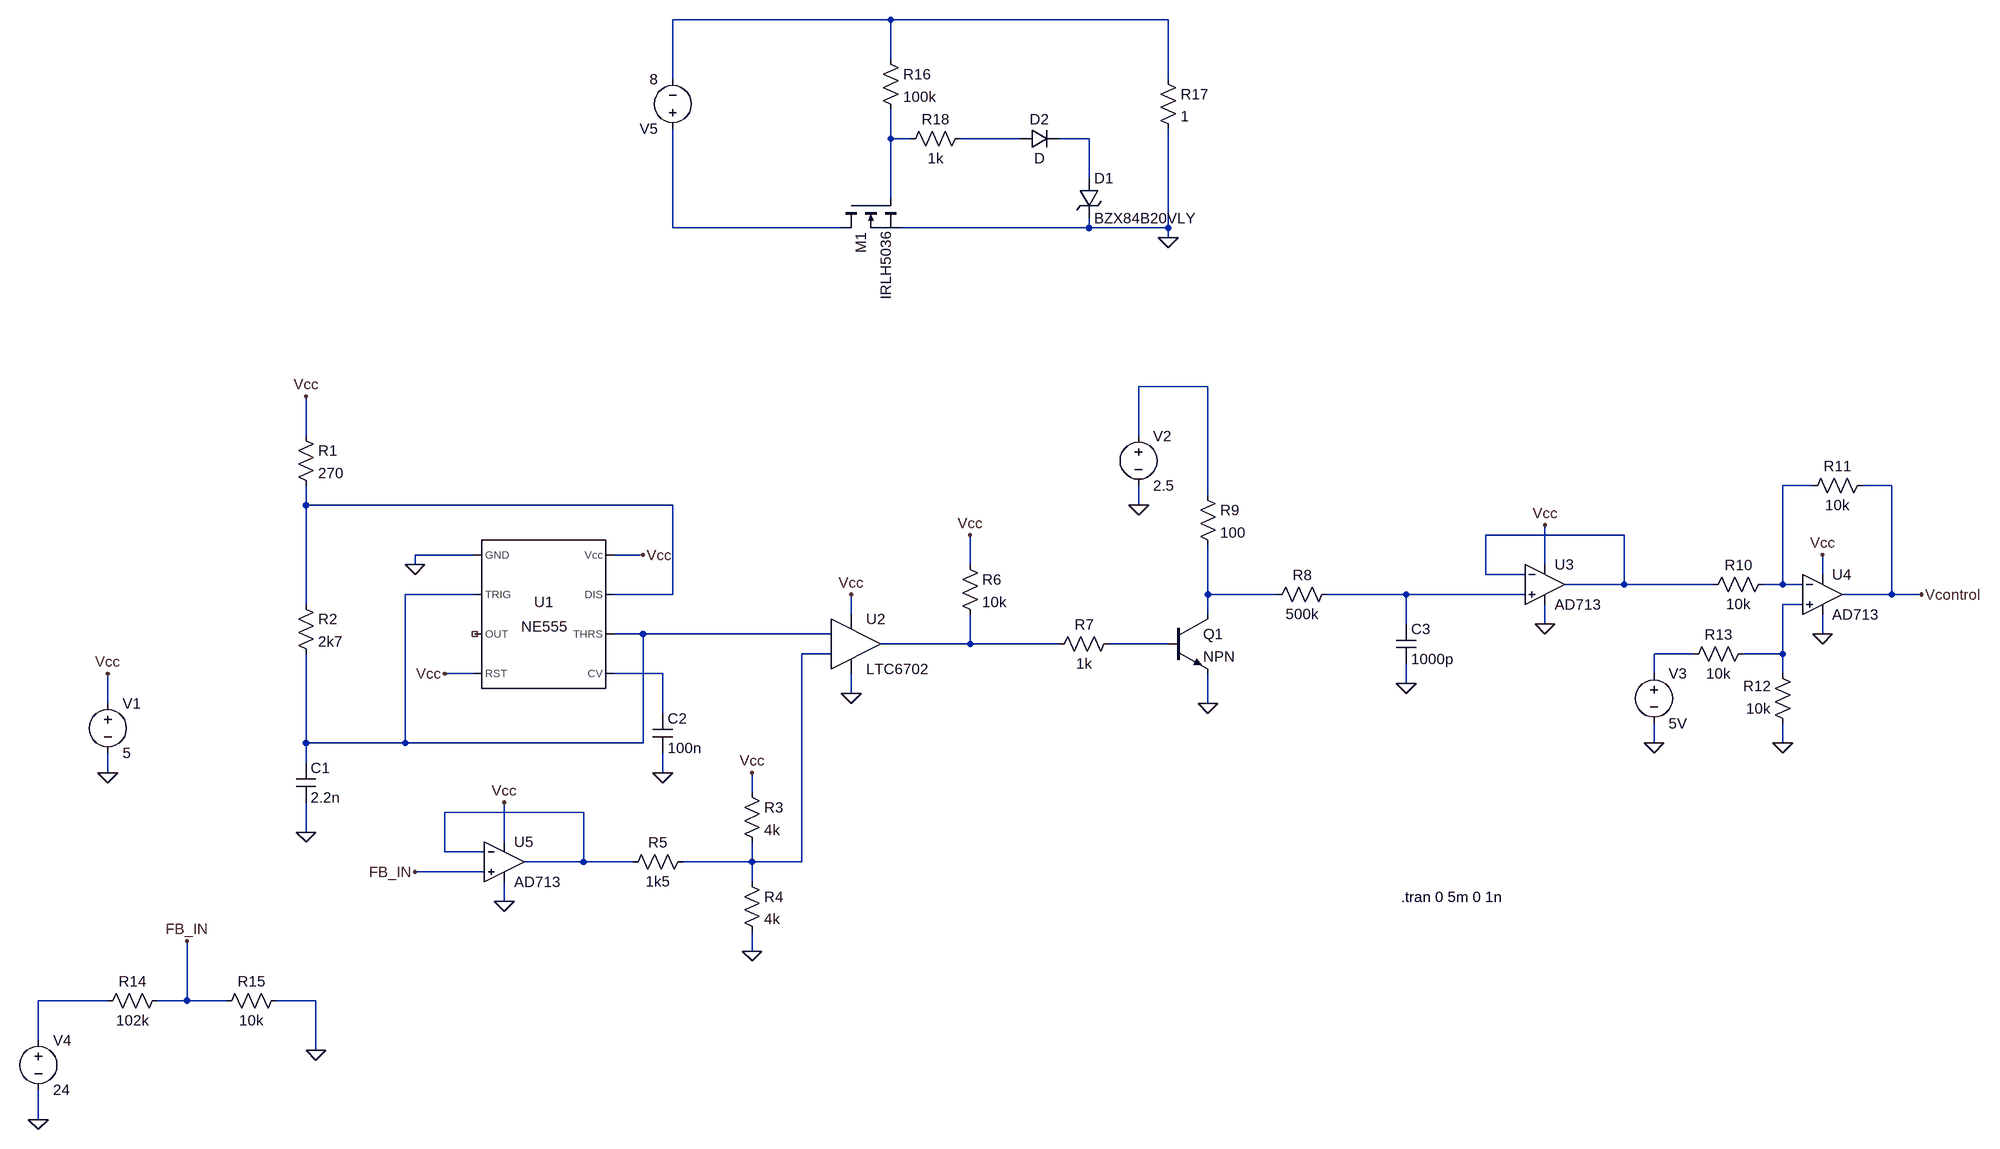
[diagram p0: schematic Draft2.asc]
Draft2.asc, the LTspice schematic file:
Version 4
SHEET 1 1492 884
WIRE -288 -912 -640 -912
WIRE 160 -912 -288 -912
WIRE -288 -848 -288 -912
WIRE -640 -816 -640 -912
WIRE 160 -816 160 -912
WIRE -288 -720 -288 -768
WIRE -256 -720 -288 -720
WIRE -80 -720 -176 -720
WIRE 32 -720 -16 -720
WIRE 32 -656 32 -720
WIRE -288 -624 -288 -720
WIRE -640 -576 -640 -736
WIRE -368 -576 -640 -576
WIRE 32 -576 32 -592
WIRE 32 -576 -272 -576
WIRE 160 -576 160 -736
WIRE 160 -576 32 -576
WIRE 160 -560 160 -576
WIRE 224 -320 112 -320
WIRE -1232 -240 -1232 -304
WIRE 112 -240 112 -320
WIRE 1200 -160 1152 -160
WIRE 1328 -160 1280 -160
WIRE 224 -144 224 -320
WIRE -1232 -128 -1232 -160
WIRE -640 -128 -1232 -128
WIRE 112 -128 112 -160
WIRE 896 -80 672 -80
WIRE -960 -48 -1056 -48
WIRE -688 -48 -736 -48
WIRE -1056 -32 -1056 -48
WIRE -160 -32 -160 -80
WIRE 768 -32 768 -96
WIRE 672 -16 672 -80
WIRE 736 -16 672 -16
WIRE 1216 -16 1216 -48
WIRE 896 0 896 -80
WIRE 896 0 800 0
WIRE 1040 0 896 0
WIRE 1152 0 1152 -160
WIRE 1152 0 1120 0
WIRE 1184 0 1152 0
WIRE -960 16 -1072 16
WIRE -640 16 -640 -128
WIRE -640 16 -736 16
WIRE 224 16 224 -64
WIRE 336 16 224 16
WIRE 544 16 416 16
WIRE 736 16 544 16
WIRE 1328 16 1328 -160
WIRE 1328 16 1248 16
WIRE 1376 16 1328 16
WIRE -1232 32 -1232 -128
WIRE 1184 32 1152 32
WIRE -352 48 -352 16
WIRE 224 48 224 16
WIRE 544 64 544 16
WIRE 768 64 768 32
WIRE -688 80 -736 80
WIRE -384 80 -688 80
WIRE 1216 80 1216 48
WIRE -160 96 -160 48
WIRE -160 96 -304 96
WIRE -16 96 -160 96
WIRE 160 96 64 96
WIRE -384 112 -432 112
WIRE 1008 112 944 112
WIRE 1152 112 1152 32
WIRE 1152 112 1088 112
WIRE -960 144 -1008 144
WIRE -656 144 -736 144
WIRE 944 144 944 112
WIRE 1152 144 1152 112
WIRE 544 160 544 128
WIRE -352 176 -352 144
WIRE -1552 192 -1552 144
WIRE 224 192 224 144
WIRE -656 208 -656 144
WIRE -1232 256 -1232 112
WIRE -1072 256 -1072 16
WIRE -1072 256 -1232 256
WIRE -688 256 -688 80
WIRE -688 256 -1072 256
WIRE 944 256 944 224
WIRE 1152 256 1152 224
WIRE -1232 288 -1232 256
WIRE -1552 304 -1552 272
WIRE -656 304 -656 272
WIRE -512 336 -512 304
WIRE -784 368 -1008 368
WIRE -1232 400 -1232 352
WIRE -912 416 -912 352
WIRE -1008 432 -1008 368
WIRE -944 432 -1008 432
WIRE -784 448 -784 368
WIRE -784 448 -880 448
WIRE -704 448 -784 448
WIRE -512 448 -512 416
WIRE -512 448 -624 448
WIRE -432 448 -432 112
WIRE -432 448 -512 448
WIRE -944 464 -1056 464
WIRE -512 480 -512 448
WIRE -912 512 -912 480
WIRE -512 592 -512 560
WIRE -1552 672 -1664 672
WIRE -1424 672 -1424 576
WIRE -1424 672 -1472 672
WIRE -1360 672 -1424 672
WIRE -1216 672 -1280 672
WIRE -1664 736 -1664 672
WIRE -1216 752 -1216 672
WIRE -1664 864 -1664 816
FLAG -1232 400 0
FLAG -1056 -32 0
FLAG -656 304 0
FLAG -1232 -304 Vcc
FLAG -688 -48 Vcc
FLAG -1008 144 Vcc
FLAG -352 176 0
FLAG -352 16 Vcc
FLAG -160 -80 Vcc
FLAG -512 592 0
FLAG -512 304 Vcc
FLAG -1552 304 0
FLAG -1552 144 Vcc
FLAG 112 -128 0
FLAG 224 192 0
FLAG 544 160 0
FLAG 768 64 0
FLAG 768 -96 Vcc
FLAG -1056 464 FB_IN
FLAG 944 256 0
FLAG 1152 256 0
FLAG 1376 16 Vcontrol
FLAG 1216 80 0
FLAG 1216 -48 Vcc
FLAG -1216 752 0
FLAG -1664 864 0
FLAG -1424 576 FB_IN
FLAG -912 512 0
FLAG -912 352 Vcc
FLAG 160 -560 0
SYMBOL Misc\\NE555 -848 48 R0
SYMATTR InstName U1
SYMBOL res -1248 -256 R0
SYMATTR InstName R1
SYMATTR Value 270
SYMBOL res -1248 16 R0
SYMATTR InstName R2
SYMATTR Value 2k7
SYMBOL cap -1248 288 R0
SYMATTR InstName C1
SYMATTR Value 2.2n
SYMBOL cap -672 208 R0
SYMATTR InstName C2
SYMATTR Value 100n
SYMBOL res -528 320 R0
SYMATTR InstName R3
SYMATTR Value 4k
SYMBOL res -528 464 R0
SYMATTR InstName R4
SYMATTR Value 4k
SYMBOL res -176 -48 R0
SYMATTR InstName R6
SYMATTR Value 10k
SYMBOL voltage -1552 176 R0
WINDOW 123 0 0 Left 0
WINDOW 39 0 0 Left 0
SYMATTR InstName V1
SYMATTR Value 5
SYMBOL Comparators\\LTC6702 -352 96 R0
SYMATTR InstName U2
SYMBOL npn 160 48 R0
SYMATTR InstName Q1
SYMBOL res 80 80 R90
WINDOW 0 0 56 VBottom 2
WINDOW 3 32 56 VTop 2
SYMATTR InstName R7
SYMATTR Value 1k
SYMBOL voltage 112 -256 R0
WINDOW 123 0 0 Left 0
WINDOW 39 0 0 Left 0
SYMATTR InstName V2
SYMATTR Value 2.5
SYMBOL cap 528 64 R0
SYMATTR InstName C3
SYMATTR Value 1000p
SYMBOL res 432 0 R90
WINDOW 0 0 56 VBottom 2
WINDOW 3 32 56 VTop 2
SYMATTR InstName R8
SYMATTR Value 500k
SYMBOL res 208 -160 R0
SYMATTR InstName R9
SYMATTR Value 100
SYMBOL OpAmps\\AD713 768 -64 R0
SYMATTR InstName U3
SYMBOL OpAmps\\AD713 1216 -48 R0
SYMATTR InstName U4
SYMBOL res 1136 -16 R90
WINDOW 0 0 56 VBottom 2
WINDOW 3 32 56 VTop 2
SYMATTR InstName R10
SYMATTR Value 10k
SYMBOL res 1296 -176 R90
WINDOW 0 0 56 VBottom 2
WINDOW 3 32 56 VTop 2
SYMATTR InstName R11
SYMATTR Value 10k
SYMBOL res 1168 240 R180
WINDOW 0 36 76 Left 2
WINDOW 3 36 40 Left 2
SYMATTR InstName R12
SYMATTR Value 10k
SYMBOL voltage 944 128 R0
WINDOW 123 0 0 Left 0
WINDOW 39 0 0 Left 0
SYMATTR InstName V3
SYMATTR Value 5V
SYMBOL res 1104 96 R90
WINDOW 0 0 56 VBottom 2
WINDOW 3 32 56 VTop 2
SYMATTR InstName R13
SYMATTR Value 10k
SYMBOL voltage -1664 720 R0
WINDOW 123 0 0 Left 0
WINDOW 39 0 0 Left 0
SYMATTR InstName V4
SYMATTR Value 24
SYMBOL res -1456 656 R90
WINDOW 0 0 56 VBottom 2
WINDOW 3 32 56 VTop 2
SYMATTR InstName R14
SYMATTR Value 102k
SYMBOL res -1264 656 R90
WINDOW 0 0 56 VBottom 2
WINDOW 3 32 56 VTop 2
SYMATTR InstName R15
SYMATTR Value 10k
SYMBOL OpAmps\\AD713 -912 384 R0
SYMATTR InstName U5
SYMBOL res -608 432 R90
WINDOW 0 0 56 VBottom 2
WINDOW 3 32 56 VTop 2
SYMATTR InstName R5
SYMATTR Value 1k5
SYMBOL voltage -640 -720 R180
WINDOW 123 0 0 Left 0
WINDOW 39 0 0 Left 0
SYMATTR InstName V5
SYMATTR Value 8
SYMBOL nmos -368 -624 M90
SYMATTR InstName M1
SYMATTR Value IRLH5036
SYMBOL zener 16 -656 R0
SYMATTR InstName D1
SYMATTR Value BZX84B20VLY
SYMBOL res -304 -864 R0
SYMATTR InstName R16
SYMATTR Value 100k
SYMBOL res 144 -832 R0
SYMATTR InstName R17
SYMATTR Value 1
SYMBOL res -160 -736 R90
WINDOW 0 0 56 VBottom 2
WINDOW 3 32 56 VTop 2
SYMATTR InstName R18
SYMATTR Value 1k
SYMBOL diode -80 -704 R270
WINDOW 0 32 32 VTop 2
WINDOW 3 0 32 VBottom 2
SYMATTR InstName D2
TEXT 536 504 Left 2 !.tran 0 5m 0 1n

The netlist it stands for:
* Draft2.asc
XU1 0 N010 NC_01 Vcc N018 N010 N008 Vcc NE555  ; pins GND TRIG OUT RST CV THRS DIS Vcc
R1 Vcc N008 270
R2 N008 N010 2k7
C1 N010 0 2.2n
C2 N018 0 100n
R3 Vcc N016 4k
R4 N016 0 4k
R6 Vcc N014 10k
V1 Vcc 0 5
XU2 N016 N010 Vcc 0 N014 LTC6702
Q1 N011 N015 0 0 NPN
R7 N015 N014 1k
V2 N006 0 2.5
C3 N012 0 1000p
R8 N012 N011 500k
R9 N006 N011 100
XU3 N012 N009 Vcc 0 N009 AD712  ; AD713, pins In+ In- V+ V- OUT
XU4 N013 N007 Vcc 0 Vcontrol AD712  ; AD713, pins In+ In- V+ V- OUT
R10 N007 N009 10k
R11 Vcontrol N007 10k
R12 0 N013 10k
V3 N017 0 5V
R13 N013 N017 10k
V4 N020 0 24
R14 FB_IN N020 102k
R15 0 FB_IN 10k
XU5 FB_IN N019 Vcc 0 N019 AD712  ; AD713, pins In+ In- V+ V- OUT
R5 N016 N019 1k5
V5 N005 N001 8
M1 N005 N002 0 0 IRLH5036
D1 N004 0 BZX84B20VLY
R16 N001 N002 100k
R17 N001 0 1
R18 N003 N002 1k
D2 N003 N004 D
.model D D
.lib standard.dio
.model NPN NPN
.model PNP PNP
.lib standard.bjt
.model NMOS NMOS
.model PMOS PMOS
.lib standard.mos
.tran 0 5m 0 1n
.lib NE555.sub
.lib LTC3.lib
.lib ADI1.lib
.backanno
.end